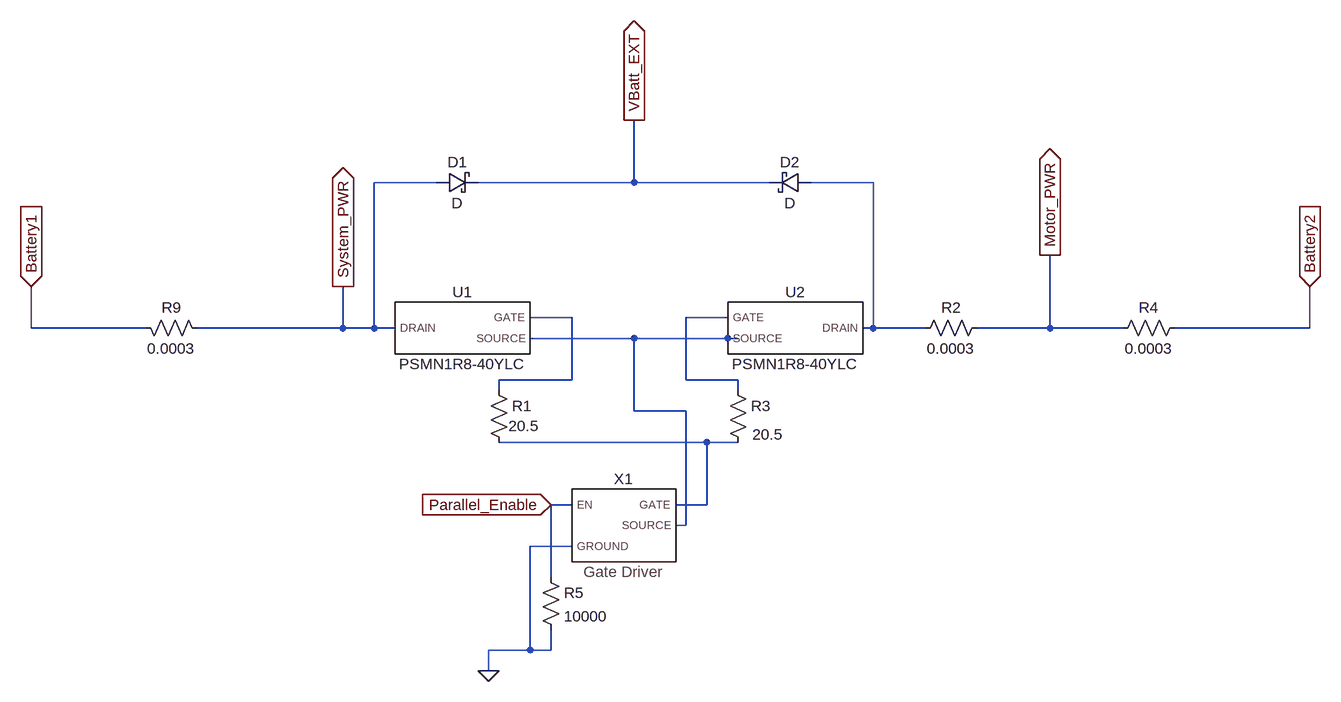
[diagram p0: schematic bridgecir_simplified.asc]
bridgecir_simplified.asc, the LTspice schematic file:
Version 4
SHEET 1 2768 680
WIRE -80 -352 -176 -352
WIRE 224 -352 224 -448
WIRE 224 -352 -16 -352
WIRE 432 -352 224 -352
WIRE 592 -352 496 -352
WIRE 128 -144 64 -144
WIRE 368 -144 304 -144
WIRE -704 -128 -704 -192
WIRE -528 -128 -704 -128
WIRE -224 -128 -224 -192
WIRE -224 -128 -448 -128
WIRE -176 -128 -176 -352
WIRE -176 -128 -224 -128
WIRE -144 -128 -176 -128
WIRE 592 -128 592 -352
WIRE 592 -128 576 -128
WIRE 672 -128 592 -128
WIRE 864 -128 864 -240
WIRE 864 -128 752 -128
WIRE 976 -128 864 -128
WIRE 1264 -128 1056 -128
WIRE 1264 -128 1264 -192
WIRE 224 -112 64 -112
WIRE 368 -112 224 -112
WIRE 384 -112 368 -112
WIRE 128 -48 128 -144
WIRE 128 -48 16 -48
WIRE 304 -48 304 -144
WIRE 384 -48 304 -48
WIRE 16 -32 16 -48
WIRE 384 -32 384 -48
WIRE 224 0 224 -112
WIRE 304 0 224 0
WIRE 336 48 16 48
WIRE 384 48 336 48
WIRE 128 144 96 144
WIRE 336 144 336 48
WIRE 336 144 288 144
WIRE 304 176 304 0
WIRE 304 176 288 176
WIRE 128 208 64 208
WIRE 96 256 96 144
WIRE 64 368 64 208
WIRE 64 368 0 368
WIRE 96 368 96 336
WIRE 96 368 64 368
WIRE 0 400 0 368
FLAG 0 400 0
FLAG 96 144 Parallel_Enable
IOPIN 96 144 In
FLAG -224 -192 System_PWR
IOPIN -224 -192 Out
FLAG 864 -240 Motor_PWR
IOPIN 864 -240 Out
FLAG -704 -192 Battery1
IOPIN -704 -192 In
FLAG 1264 -192 Battery2
IOPIN 1264 -192 In
FLAG 224 -448 VBatt_EXT
IOPIN 224 -448 Out
SYMBOL gatedriver 208 176 R0
SYMATTR InstName X1
SYMBOL res 0 -48 R0
WINDOW 3 31 71 Left 2
SYMATTR Value 20.5
SYMATTR InstName R1
SYMBOL res 368 -48 R0
WINDOW 3 38 84 Left 2
SYMATTR Value 20.5
SYMATTR InstName R3
SYMBOL res 80 240 R0
SYMATTR InstName R5
SYMATTR Value 10000
SYMBOL AutoGenerated\\PSMN1R8-40YLC -48 -128 R0
SYMATTR InstName U1
SYMBOL AutoGenerated\\PSMN1R8-40YLC 480 -128 M0
SYMATTR InstName U2
SYMBOL res 768 -144 R90
WINDOW 0 0 56 VBottom 2
WINDOW 3 32 56 VTop 2
SYMATTR InstName R2
SYMATTR Value 0.0003
SYMBOL res 1072 -144 R90
WINDOW 0 0 56 VBottom 2
WINDOW 3 32 56 VTop 2
SYMATTR InstName R4
SYMATTR Value 0.0003
SYMBOL res -544 -144 M90
WINDOW 0 0 56 VBottom 2
WINDOW 3 32 56 VTop 2
SYMATTR InstName R9
SYMATTR Value 0.0003
SYMBOL schottky -80 -336 R270
WINDOW 0 32 32 VTop 2
WINDOW 3 0 32 VBottom 2
SYMATTR InstName D1
SYMBOL schottky 496 -368 R90
WINDOW 0 0 32 VBottom 2
WINDOW 3 32 32 VTop 2
SYMATTR InstName D2

The netlist it stands for:
* bridgecir_simplified.asc
XX1 Parallel_Enable N005 0 N004 gatedriver  ; pins EN GATE GROUND SOURCE
R1 N002 N005 20.5
R3 N003 N005 20.5
R5 Parallel_Enable 0 10000
XU1 System_PWR N002 N004 PSMN1R8-40YLC  ; pins DRAIN GATE SOURCE
XU2 N001 N003 N004 PSMN1R8-40YLC  ; pins DRAIN GATE SOURCE
R2 Motor_PWR N001 0.0003
R4 Battery2 Motor_PWR 0.0003
R9 Battery1 System_PWR 0.0003
D1 System_PWR VBatt_EXT D
D2 N001 VBatt_EXT D
.model D D
.lib standard.dio
.lib C:\Poorna\OneDrive - University of Victoria\University\2020\Summer 2020\ECE 499\Schematic\LTSpice\models\PSMN1R8-40YLC.lib
.backanno
.end